# EAGLE design display (EAGLE 5.02)
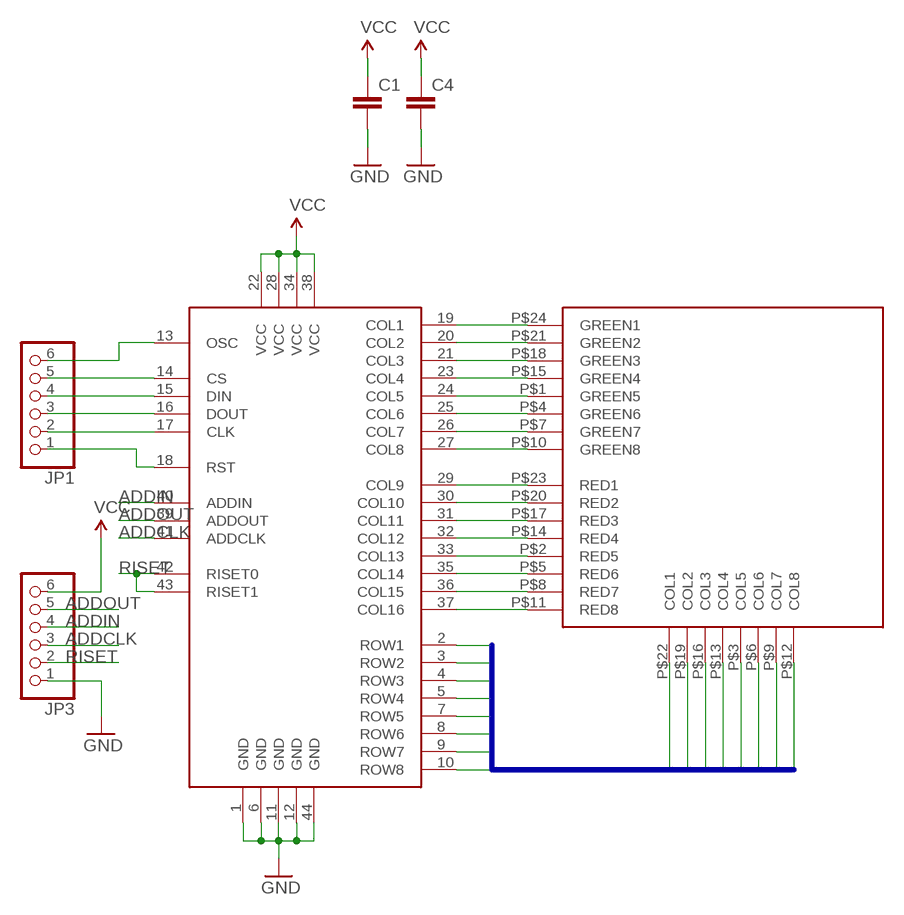
[diagram p0: schematic, sheet 1]

## Parts
C1  CAP0603  [0603]
C4  CAP0603  [0603]
JP1  PINHD-1X6  [1X06]
JP3  PINHD-1X6  [1X06]
U$1  FYM-1228AXX  [FYM-12881ABXX]
U$2  MAX6960  [TQFP44]

## Nets
ADDCLK: JP3.3 U$2.41(ADDCLK)
ADDIN: JP3.4 U$2.40(ADDIN)
ADDOUT: JP3.5 U$2.39(ADDOUT)
CLK: JP1.2 U$2.17(CLK)
CS: JP1.5 U$2.14(CS)
DIN: JP1.4 U$2.15(DIN)
DOUT: JP1.3 U$2.16(DOUT)
GND: C1.2 C4.2 JP3.1 U$2.1(GND) U$2.6(GND) U$2.11(GND) U$2.12(GND) U$2.44(GND)
N$1: U$1.P$24(GREEN1) U$2.19(COL1)
N$2: U$1.P$21(GREEN2) U$2.20(COL2)
N$3: U$1.P$18(GREEN3) U$2.21(COL3)
N$4: U$1.P$15(GREEN4) U$2.23(COL4)
N$5: U$1.P$1(GREEN5) U$2.24(COL5)
N$6: U$1.P$4(GREEN6) U$2.25(COL6)
N$7: U$1.P$7(GREEN7) U$2.26(COL7)
N$8: U$1.P$10(GREEN8) U$2.27(COL8)
N$9: U$1.P$23(RED1) U$2.29(COL9)
N$10: U$1.P$20(RED2) U$2.30(COL10)
N$11: U$1.P$17(RED3) U$2.31(COL11)
N$12: U$1.P$14(RED4) U$2.32(COL12)
N$13: U$1.P$2(RED5) U$2.33(COL13)
N$14: U$1.P$5(RED6) U$2.35(COL14)
N$15: U$1.P$8(RED7) U$2.36(COL15)
N$16: U$1.P$11(RED8) U$2.37(COL16)
OSC: JP1.6 U$2.13(OSC)
RISET: JP3.2 U$2.42(RISET0) U$2.43(RISET1)
ROW1: U$1.P$22(COL1) U$2.2(ROW1)
ROW2: U$1.P$19(COL2) U$2.3(ROW2)
ROW3: U$1.P$16(COL3) U$2.4(ROW3)
ROW4: U$1.P$13(COL4) U$2.5(ROW4)
ROW5: U$1.P$3(COL5) U$2.7(ROW5)
ROW6: U$1.P$6(COL6) U$2.8(ROW6)
ROW7: U$1.P$9(COL7) U$2.9(ROW7)
ROW8: U$1.P$12(COL8) U$2.10(ROW8)
RST: JP1.1 U$2.18(RST)
VCC: C1.1 C4.1 JP3.6 U$2.22(VCC) U$2.28(VCC) U$2.34(VCC) U$2.38(VCC)

## Buses
ROW[1..8]

## Library data of the parts
C1 C4 = SparkFun:CAP: Capacitor Standard 0603 ceramic capacitor, and 0.1" leaded capacitor.
JP1 JP3 = pinhead:PINHD-1X6: PIN HEADER
U$1 = john:FYM-1228AXX
U$2 = maxim:MAX6960

## Board
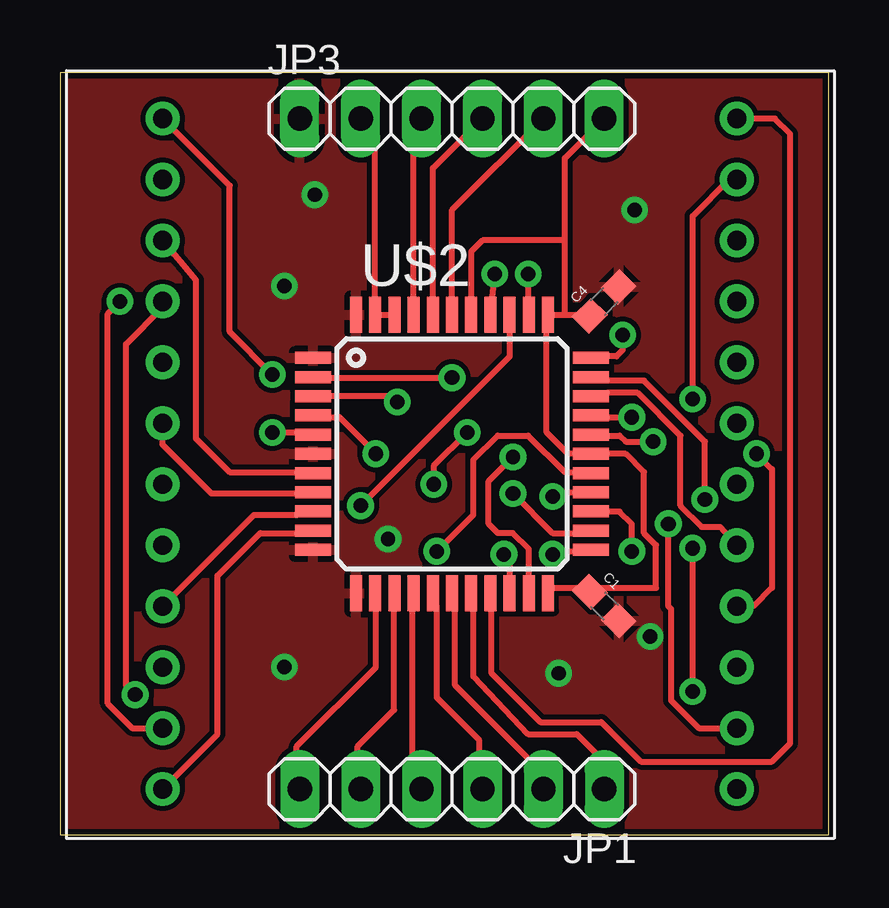
[diagram p1: board, top side]
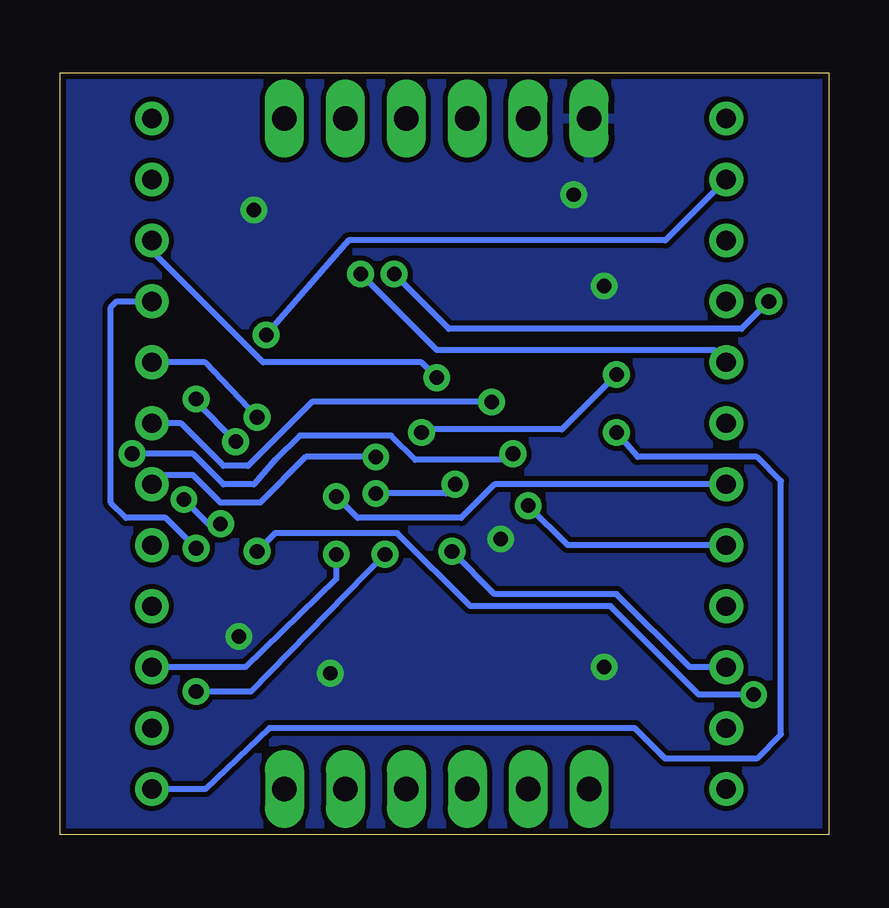
[diagram p2: board, bottom side, seen from below]

Size 32.05 x 31.74 mm. Coordinates in mm from the lower left corner, seen from the top.
Outline: 0,0 32.05,0 32.05,31.74 0,31.74 0,0
Copper layers (1*16): Top 0.035mm / dielectric 1.5mm / Bottom 0.035mm
Design rules "SparkFun": minimum track width 8mil, minimum drill 20mil, track to track 8mil, track to pad 8mil, pad to pad 8mil, via to via 8mil, smd to smd 8mil, copper to edge 10mil, drill to drill 8mil, minimum pad ring 12mil, minimum via ring 10mil, stop-mask expansion 4mil, vias tented up to drill 25mil, thermal gap 10mil

### Footprints (pad centres in the part's own frame; a part is rotated, then mirrored left to right if it is on the bottom)
0603 = smd 1.1 x 1: 1 -0.85,0; 2 0.85,0
1X06 = drill 1.016 long: 1 -6.35,0; 2 -3.81,0; 3 -1.27,0; 4 1.27,0; 5 3.81,0; 6 6.35,0
FYM-12881ABXX = drill 0.8 round: P$1 0,0; P$2 0,-2.54; P$3 0,-5.08; P$4 0,-7.62; P$5 0,-10.16; P$6 0,-12.7; P$7 0,-15.24; P$8 0,-17.78; P$9 0,-20.32; P$10 0,-22.86; P$11 0,-25.4; P$12 0,-27.94; P$13 23.94,-27.94; P$14 23.94,-25.4; P$15 23.94,-22.86; P$16 23.94,-20.32; P$17 23.94,-17.78; P$18 23.94,-15.24; P$19 23.94,-12.7; P$20 23.94,-10.16; P$21 23.94,-7.62; P$22 23.94,-5.08; P$23 23.94,-2.54; P$24 23.94,0
TQFP44 = smd 1.5 x 0.5: 1 -5.8,4; 2 -5.8,3.2; 3 -5.8,2.4; 4 -5.8,1.6; 5 -5.8,0.8; 6 -5.8,0; 7 -5.8,-0.8; 8 -5.8,-1.6; 9 -5.8,-2.4; 10 -5.8,-3.2; 11 -5.8,-4; 23 5.8,-4; 24 5.8,-3.2; 25 5.8,-2.4; 26 5.8,-1.6; 27 5.8,-0.8; 28 5.8,0; 29 5.8,0.8; 30 5.8,1.6; 31 5.8,2.4; 32 5.8,3.2; 33 5.8,4 | smd 0.5 x 1.5: 12 -4,-5.8; 13 -3.2,-5.8; 14 -2.4,-5.8; 15 -1.6,-5.8; 16 -0.8,-5.8; 17 0,-5.8; 18 0.8,-5.8; 19 1.6,-5.8; 20 2.4,-5.8; 21 3.2,-5.8; 22 4,-5.8; 34 4,5.8; 35 3.2,5.8; 36 2.4,5.8; 37 1.6,5.8; 38 0.8,5.8; 39 0,5.8; 40 -0.8,5.8; 41 -1.6,5.8; 42 -2.4,5.8; 43 -3.2,5.8; 44 -4,5.8

### Placement (x,y rotation side)
C1  22.7,9.52 315 top
C4  22.7,22.22 45 top
JP1  16.34,1.9 180 top
JP3  16.34,29.84 0 top
U$1  4.28,29.84 0 top
U$2  16.34,15.87 0 top

### Tracks (layer width: path | path; a pad name or v marks a point on that pad's centre or on a via)
ADDCLK
  Top 0.254: U$2.41 14.74,29.51 JP3.3
ADDIN
  Top 0.254: U$2.40 15.54,27.77 JP3.4
ADDOUT
  Top 0.254: U$2.39 16.34,26.03 JP3.5
CLK
  Top 0.254: U$2.17 16.47,9.52 16.47,6.22 20.03,2.66 20.03,2.28 JP1.2
CS
  Top 0.254: U$2.14 13.93,9.52 13.93,5.2 12.41,3.68 12.41,2.66 JP1.5
DIN
  Top 0.254: U$2.15 14.69,9.52 14.69,3.17 JP1.4
DOUT
  Top 0.254: U$2.16 15.71,9.52 15.71,5.71 17.49,3.93 17.49,2.92 JP1.3
GND  (via drill 0.6)
  other vias: 23.96,26.03 9.36,6.98 24.6,8.25 13.68,12.31 20.79,6.73 10.63,26.66 9.36,22.86
  pour Bottom: 0.47,31.74 32.22,31.74 32.22,-0.01 0.47,-0.01
  pour Top: 0.47,31.74 32.22,31.74 32.22,-0.01 0.47,-0.01
N$1
  Top 0.254: U$2.19 18,9.52 18,6.73 20.03,4.69 22.57,4.69 24.22,3.04 29.68,3.04 30.44,3.81 30.44,29.2 29.81,29.84 U$1.P$24
N$2  (via drill 0.61)
  Top 0.254: v18.5,11.68 18.76,11.3 18.76,10.79 U$2.20 | v26.38,5.96 v26.38,11.93
  Bottom 0.254: v18.5,11.68 24.09,5.96 v26.38,5.96 | v26.38,11.93 27.65,13.2 29.3,13.2 29.93,13.84 29.93,21.97 29.68,22.22 U$1.P$21
N$3  (via drill 0.6)
  Top 0.254: U$2.21 19.54,11.91 18.88,12.57 18.25,12.57 17.87,12.95 17.87,14.73 v18.88,15.74
  Bottom 0.254: v18.88,15.74 21.81,15.74 23.71,13.84 25.36,13.84 26.5,14.98 27.9,14.98 28.28,14.6 U$1.P$18
N$4  (via drill 0.61)
  Top 0.254: v20.54,11.68 20.66,11.81 21.55,11.81 U$2.23
  Bottom 0.254: v20.54,11.68 20.54,10.66 24.35,6.98 U$1.P$15
N$5  (via drill 0.61)
  Top 0.254: v18.88,14.22 20.54,12.57 21.55,12.57 U$2.24 | v16.98,16.76 15.58,15.36 v15.58,14.6 | v8.85,19.17 7.07,20.95 7.07,27.05 U$1.P$1
  Bottom 0.254: v15.58,14.6 15.96,14.22 v18.88,14.22 | v16.98,16.76 16.73,16.89 11.14,16.89 v8.85,19.17
N$6  (via drill 0.61)
  Top 0.254: v23.84,11.81 23.84,12.95 23.33,13.46 22.06,13.46 U$2.25 | v3.14,5.84 2.76,6.22 2.76,20.44 4.28,21.97 | 4.28,21.97 4.28,21.84 | 4.28,21.97 U$1.P$4
  Bottom 0.254: v23.84,11.81 23.08,12.57 18,12.57 14.95,9.52 9.11,9.52 5.42,5.84 v3.14,5.84
N$7  (via drill 0.6)
  Top 0.254: U$2.26 20.71,14.27 v20.54,14.09
  Bottom 0.254: v20.54,14.09 19.65,13.2 15.33,13.2 13.93,14.6 U$1.P$7
N$8  (via drill 0.61)
  Top 0.254: v15.71,11.81 17.23,13.33 17.23,15.62 18.25,16.63 19.52,16.63 21.04,15.11 21.93,15.11 U$2.27
  Bottom 0.254: v15.71,11.81 13.93,10.03 8.85,10.03 5.8,6.98 U$1.P$10
N$9  (via drill 0.61)
  Top 0.254: v24.73,16.38 23.58,16.38 23.33,16.63 22.82,16.63 U$2.29 | v26.38,18.16 26.38,25.78 27.9,27.3 U$1.P$23
  Bottom 0.254: v24.73,16.38 26.38,18.03 v26.38,18.16
N$10  (via drill 0.61)
  Top 0.254: U$2.30 22.19,17.52 22.31,17.39 v23.84,17.39
  Bottom 0.254: v23.84,17.39 26,19.68 U$1.P$20
N$11
  Top 0.254: U$2.31 22.82,18.41 24.09,18.41 25.87,16.63 25.87,13.71 26.76,12.82 27.52,12.82 U$1.P$17
N$12  (via drill 0.61)
  Top 0.254: v26.89,13.96 26.89,16.38 24.35,18.92 22.82,18.92 U$2.32 | v25.36,12.95 25.36,9.52 25.49,9.39 25.49,5.58 26.63,4.44 U$1.P$14
  Bottom 0.254: v26.89,13.96 25.87,12.95 v25.36,12.95
N$13  (via drill 0.61)
  Top 0.254: v23.46,20.82 23.46,20.19 23.2,19.93 22.82,19.93 U$2.33
  Bottom 0.254: v23.46,20.82 20.03,24.76 6.82,24.76 U$1.P$2
N$14  (via drill 0.61)
  Top 0.254: v19.52,23.36 19.52,22.22 U$2.35
  Bottom 0.254: v19.52,23.36 16.34,20.19 4.79,20.19 U$1.P$5
N$15  (via drill 0.61)
  Top 0.254: v12.54,13.71 18.76,19.93 18.76,20.95 U$2.36
  Bottom 0.254: v12.54,13.71 10.88,12.06 U$1.P$8
N$16  (via drill 0.61)
  Top 0.254: v18.12,23.36 18,22.22 U$2.37 | v2.5,22.22 1.99,21.71 1.99,5.46 3.01,4.44 U$1.P$11
  Bottom 0.254: v18.12,23.36 15.84,21.08 3.65,21.08 v2.5,22.22
OSC
  Top 0.254: U$2.13 13.17,9.52 13.17,6.98 9.87,3.68 9.87,2.66 JP1.6
RISET
  Top 0.254: JP3.2 13.14,29.23 U$2.43 13.72,21.67 13.8,21.59 13.89,21.67 U$2.42
ROW1  (via drill 0.61)
  Top 0.254: v16.34,19.04 10.88,19.04 U$2.2
  Bottom 0.254: v16.34,19.04 16.98,19.68 23.58,19.68 28.16,24.25 28.16,24.63 U$1.P$22
ROW2  (via drill 0.61)
  Top 0.254: v14.06,18.03 13.8,18.28 10.76,18.28 U$2.3
  Bottom 0.254: v14.06,18.03 21.55,18.03 24.22,15.36 25.23,15.36 27.01,17.14 U$1.P$19
ROW3  (via drill 0.61)
  Top 0.254: v13.17,15.87 11.65,17.39 11.14,17.39 U$2.4 | v29.04,15.87 29.68,15.23 29.68,10.28 28.92,9.52 U$1.P$16
  Bottom 0.254: v13.17,15.87 13.42,15.62 17.23,15.62 18.25,16.63 22.06,16.63 23.08,15.62 23.96,14.6 25.23,14.6 26.5,15.87 v29.04,15.87
ROW4  (via drill 0.61)
  Top 0.254: v8.85,16.76 9.87,16.76 U$2.5
  Bottom 0.254: v8.85,16.76 7.96,15.74 3.01,15.74 1.99,14.73 1.99,4.19 3.01,3.17 6.82,3.17 8.09,4.44 23.33,4.44 26,1.9 U$1.P$13
ROW5
  Top 0.254: U$2.7 10.51,15.11 9.87,15.11 7.07,15.11 5.68,16.5 5.68,23.11 U$1.P$3
ROW6
  Top 0.254: U$2.8 9.99,14.22 6.31,14.22 4.28,16.25 U$1.P$6
ROW7
  Top 0.254: U$1.P$9 8.09,13.33 9.87,13.33 U$2.9
ROW8
  Top 0.254: U$1.P$12 6.57,4.19 6.57,10.79 8.34,12.57 9.87,12.57 U$2.10
RST
  Top 0.254: U$2.18 17.23,9.52 17.23,6.6 19.52,4.19 21.55,4.19 22.57,3.17 22.57,2.15 JP1.1
VCC
  Top 0.254: U$2.22 20.54,10.28 21.55,10.28 C1.1 22.57,10.28 24.85,10.28 24.85,12.06 24.35,12.57 24.35,15.11 23.58,15.87 U$2.28 21.17,15.87 20.28,16.76 20.28,20.95 U$2.34 21.04,21.67 | U$2.38 17.14,24.29 17.61,24.76 21.04,24.76 | JP3.6 21.04,28.19 21.04,24.76 | 21.04,21.67 21.04,24.76 | 22.06,21.62 22.06,21.59 | 22.06,21.62 C4.1 | 21.04,21.67 22.06,21.67 22.06,21.62